# EAGLE schematic baterry tester (EAGLE 9.1.2)
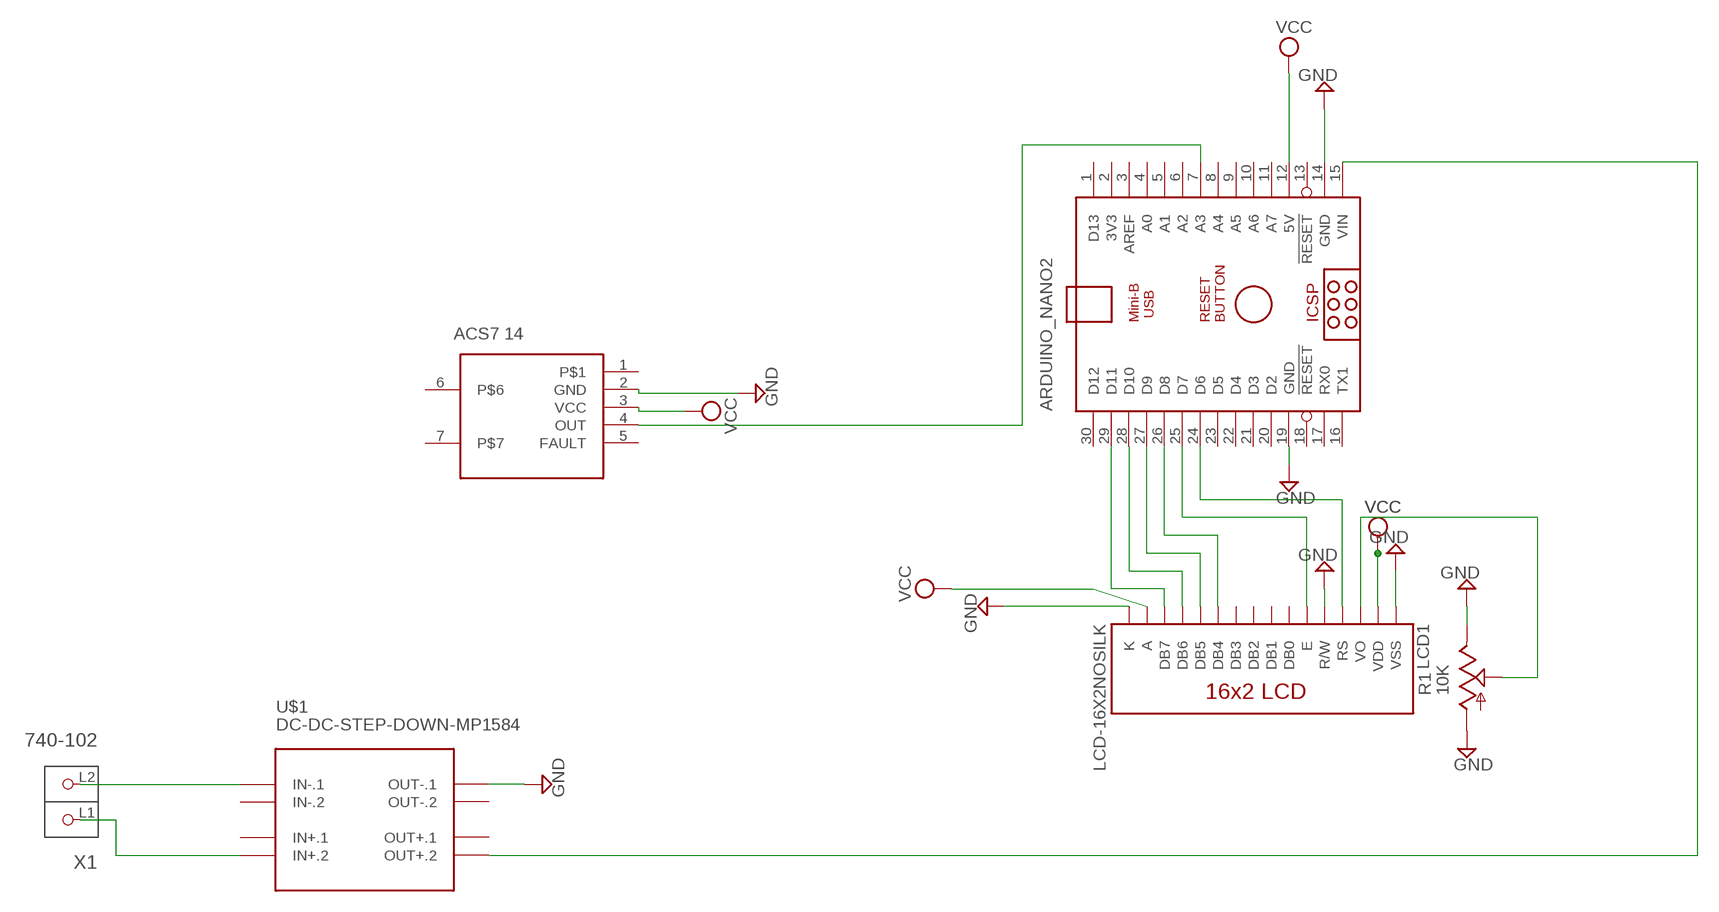
[diagram p0: schematic, sheet 1]

## Parts
ARDUINO_NANO2  ARDUINO_NANO  [ARDUINO_NANO]
LCD1  LCD-16X2NOSILK  [LCD-16X2_NOSILK]
R1  10K  TRIM_US-PT10  [PT-10]
U$1  DC-DC-STEP-DOWN-MP1584  [DC-DC-STEP-DOWN-MP1584]
U$3  ACS714EGHII-ACS714  [ACS714E]
X1  740-102  [P-740-102]

## Nets
GND [power]: ARDUINO_NANO2.14(GND) ARDUINO_NANO2.19(GND) LCD1.1(VSS) LCD1.5(R/W) LCD1.16(K) R1.A R1.E U$1.OUT-.1 U$3.2(GND)
N$1 [Data]: LCD1.3(VO) R1.S
N$2 [Data]: ARDUINO_NANO2.29(D11) LCD1.14(DB7)
N$3 [Data]: ARDUINO_NANO2.28(D10) LCD1.13(DB6)
N$4 [Data]: ARDUINO_NANO2.27(D9) LCD1.12(DB5)
N$5 [Data]: ARDUINO_NANO2.26(D8) LCD1.11(DB4)
N$6 [Data]: ARDUINO_NANO2.25(D7) LCD1.6(E)
N$7 [Data]: ARDUINO_NANO2.24(D6) LCD1.4(RS)
N$9 [Data]: ARDUINO_NANO2.7(A3) U$3.4(OUT)
N$10 [power]: ARDUINO_NANO2.15(VIN) U$1.OUT+.2
N$11 [power]: U$1.IN-.1 X1.L2(P2)
N$12 [power]: U$1.IN+.2 X1.L1(P1)
VCC [power]: ARDUINO_NANO2.12(5V) LCD1.2(VDD) LCD1.15(A) U$3.3(VCC)
Unconnected: ARDUINO_NANO2.1(D13) ARDUINO_NANO2.2(3V3) ARDUINO_NANO2.3(AREF) ARDUINO_NANO2.4(A0) ARDUINO_NANO2.5(A1) ARDUINO_NANO2.6(A2) ARDUINO_NANO2.8(A4) ARDUINO_NANO2.9(A5) ARDUINO_NANO2.10(A6) ARDUINO_NANO2.11(A7) ARDUINO_NANO2.13(!RESET) ARDUINO_NANO2.16(TX1) ARDUINO_NANO2.17(RX0) ARDUINO_NANO2.18(!RESET) ARDUINO_NANO2.20(D2) ARDUINO_NANO2.21(D3) ARDUINO_NANO2.22(D4) ARDUINO_NANO2.23(D5) ARDUINO_NANO2.30(D12) LCD1.7(DB0) LCD1.8(DB1) LCD1.9(DB2) LCD1.10(DB3) U$1.IN+.1 U$1.IN-.2 U$1.OUT+.1 U$1.OUT-.2 U$3.1 U$3.5(FAULT) U$3.6 U$3.7

## Library data of the parts
ARDUINO_NANO2 = ArduinoNanoV30 GHIT:ARDUINO_NANO: Arduino Nano V3.0 Overview: The Arduino Nano is a small, complete, and breadboard-friendly board based on the ATmega328 (Arduino Nano 3.x) or ATmega168 (Arduino Nano 2.x). It has more or less the same functionality of the Arduino Duemilanove, but in a different package. It lacks only a DC power jack, and works with a Mini-B USB cable instead of a standard one. The Nano was designed and is being produced by Gravitech. Specifications: Microcontroller Atmel ATmega168 or ATmega328 Operating Voltage (logic level) 5 V Input Voltage (recommended) 7-12 V Input Voltage (limits) 6-20 V Digital I/O Pins 14 (of which 6 provide PWM output) Analog Input Pins 8 DC Current per I/O Pin 40 mA Flash Memory 16 KB (ATmega168) or 32 KB (ATmega328) of which 2 KB used by bootloader SRAM 1 KB (ATmega168) or 2 KB (ATmega328) EEPROM 512 bytes (ATmega168) or 1 KB (ATmega328) Clock Speed 16 MHz Dimensions 0.73" x 1.70" Length 45 mm Width 18 mm Weigth 5 g Power: The Arduino Nano can be powered via the Mini-B USB connection, 6-20V unregulated external power supply (pin 30), or 5V regulated external power supply (pin 27). The power source is automatically selected to the highest voltage source. Memory: The ATmega168 has 16 KB of flash memory for storing code (of which 2 KB is used for the bootloader); the ATmega328 has 32 KB, (also with 2 KB used for the bootloader). The ATmega168 has 1 KB of SRAM and 512 bytes of EEPROM (which can be read and written with the EEPROM library); the ATmega328 has 2 KB of SRAM and 1 KB of EEPROM. Input and Output: Each of the 14 digital pins on the Nano can be used as an input or output, using pinMode(), digitalWrite(), and digitalRead() functions. They operate at 5 volts. Each pin can provide or receive a maximum of 40 mA and has an internal pull-up resistor (disconnected by default) of 20-50 kOhms. In addition, some pins have specialized functions. Visit Arduino - ArduinoBoardNano <https://www.arduino.cc/en/Main/ArduinoBoardNano>
LCD1 = SparkFun-Displays:LCD-16X2: Standard text-only 16x2 parallel input LCD Basic 16 character by 2 line display. Typically utilizes the extremely common HD44780 parallel interface chipset SparkFun Products: Basic 16x2 Green <https://www.sparkfun.com/products/255> Basic 8x2 Green <https://www.sparkfun.com/products/11122>; SF_ID: LCD-00255
R1 = pot:TRIM_US-: POTENTIOMETER
U$1 = GHIdiy-modules:DC-DC-STEP-DOWN-MP1584: DC/DC Step-Down Regulator based on MP1584 chip MP1584 datasheet available here: http://www.haoyuelectronics.com/Attachment/MP1584/MP1584.pdf Click here to find device on ebay.com <http://www.ebay.com/sch/mp1584+module>
U$3 = Current  senosor:ACS714E
X1 = con-wago_740:740-102: Serie 740, Klemmenleiste für Leiterplatten 1 Lötstift/Pol / Series 740, PCB terminal strip 1 solder pin/pole Polzahl / Pole No.: 2 Rastermaß / Pitch: 5 mm Bemessungsspannung / Rated Voltage: 320 V Nennstrom / Nominal Current: 16 A Leiterquerschnitt / Conductor Size: 0.08 - 2.5 mm² Anschlusstechnik / Connection Technology: CAGE CLAMP® Lötstiftlänge: / Solder Pin Length: 5.1 mm Leitereinführung (zur Platine) / Conductor entry angle (to PCB): 0 ° Farbe / Color: grau / gray Stand: 01.01.2012. Die jeweils aktuellen Daten zu diesem Artikel finden Sie in unserem Produktkatalog, den Sie unter www.wago.com einsehen können. As of: 01/01/2012. Please find the newest data for this article in our product catalogue, which can be viewed under www.wago.com.

## Net classes
1 power: width 0.762 mm, drill 0.762 mm, clearance 0.635 mm
2 Data: width 0.762 mm, drill 0.762 mm, clearance 0.635 mm